# Altium schematic sheet Motor1.SchDoc
size A3; DocumentNumber: 2; SheetNumber: 4; SheetTotal: 5
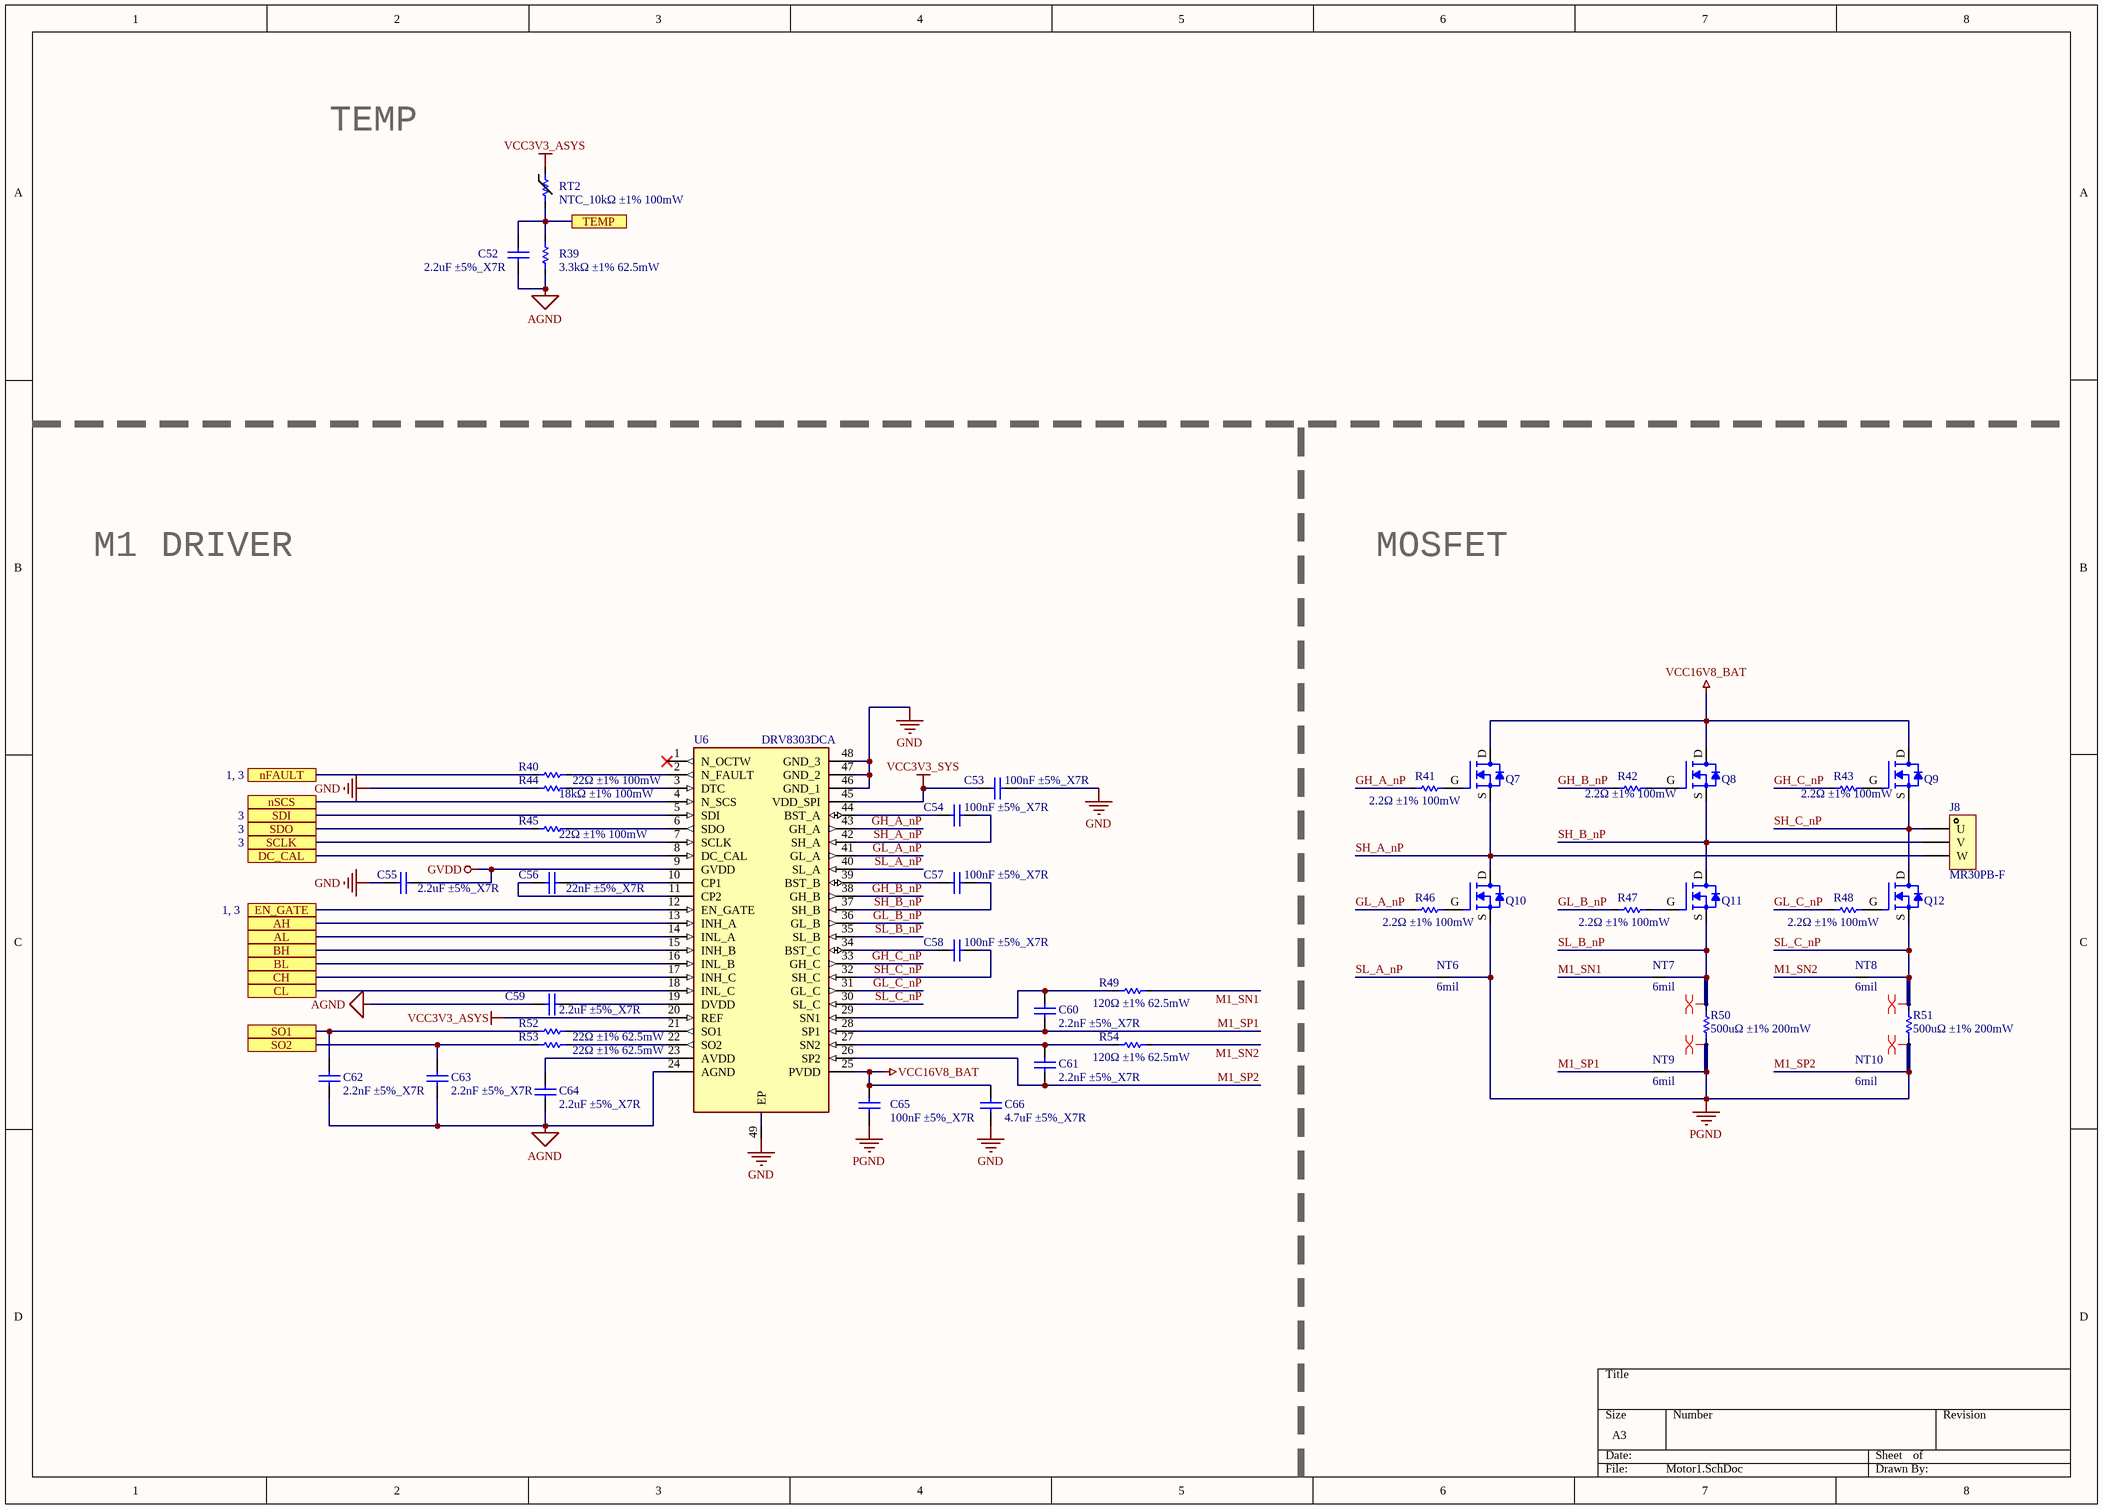
[diagram p0: Motor1.SchDoc]

## Parts
C52  2.2uF ±5%_X7R  [C0402]
C53  100nF ±5%_X7R  [C0402]
C54  100nF ±5%_X7R  [C0402]
C55  2.2uF ±5%_X7R  [C0402]
C56  22nF ±5%_X7R  [C0402]
C57  100nF ±5%_X7R  [C0402]
C58  100nF ±5%_X7R  [C0402]
C59  2.2uF ±5%_X7R  [C0402]
C60  2.2nF ±5%_X7R  [C0402]
C61  2.2nF ±5%_X7R  [C0402]
C62  2.2nF ±5%_X7R  [C0402]
C63  2.2nF ±5%_X7R  [C0402]
C64  2.2uF ±5%_X7R  [C0402]
C65  100nF ±5%_X7R  [C0402]
C66  4.7uF ±5%_X7R  [C0603]
J8  MR30PB-F  [MR30PB-F [Straight] [SMT]]
NT6  6mil  [NETTIE_6mil]  (net tie, no BOM)
NT7  6mil  [NETTIE_6mil]  (net tie, no BOM)
NT8  6mil  [NETTIE_6mil]  (net tie, no BOM)
NT9  6mil  [NETTIE_6mil]  (net tie, no BOM)
NT10  6mil  [NETTIE_6mil]  (net tie, no BOM)
Q7  BSC027N04LSG  [NRVTS10100EMFST1G]  (value not drawn)
Q8  BSC027N04LSG  [NRVTS10100EMFST1G]  (value not drawn)
Q9  BSC027N04LSG  [NRVTS10100EMFST1G]  (value not drawn)
Q10  BSC027N04LSG  [NRVTS10100EMFST1G]  (value not drawn)
Q11  BSC027N04LSG  [NRVTS10100EMFST1G]  (value not drawn)
Q12  BSC027N04LSG  [NRVTS10100EMFST1G]  (value not drawn)
R39  3.3kΩ ±1% 62.5mW  [R0402]
R40  22Ω ±1% 100mW  [R0402]
R41  2.2Ω ±1% 100mW  [R0402]
R42  2.2Ω ±1% 100mW  [R0402]
R43  2.2Ω ±1% 100mW  [R0402]
R44  18kΩ ±1% 100mW  [R0402]
R45  22Ω ±1% 100mW  [R0402]
R46  2.2Ω ±1% 100mW  [R0402]
R47  2.2Ω ±1% 100mW  [R0402]
R48  2.2Ω ±1% 100mW  [R0402]
R49  120Ω ±1% 62.5mW  [R0402]
R50  500uΩ ±1% 200mW  [R2512]
R51  500uΩ ±1% 200mW  [R2512]
R52  22Ω ±1% 62.5mW  [R0402]
R53  22Ω ±1% 62.5mW  [R0402]
R54  120Ω ±1% 62.5mW  [R0402]
RT2  NTC_10kΩ ±1% 100mW  [R0402]
U6  DRV8303DCA  [SOP50P810X120-49N]

## Ports
AH, AL, BH, BL, CH, CL, DC_CAL, EN_GATE (see 1, 3), nFAULT (see 1, 3), nSCS, SCLK (see 3), SDI (see 3), SDO (see 3), SO1, SO2, TEMP

## Nets
AGND: C52.1 C59.2 C62.1 C63.1 C64.1 R39.1 U6.24(AGND)
GND: C53.1 C55.1 C66.1 R44.2 U6.46(GND_1) U6.47(GND_2) U6.48(GND_3) U6.49(EP)
GVDD: C55.2 U6.9(GVDD)
PGND: C65.1 NT6.1 NT9.2 NT10.2 Q10.S R50.1 R51.1
VCC3V3_ASYS: RT2.1 U6.20(REF)
VCC3V3_SYS: C53.2 U6.45(VDD_SPI)
VCC16V8_BAT: C65.2 C66.2 Q7.D Q8.D Q9.D U6.25(PVDD)
AH: U6.13(INH_A) ; port AH
AL: U6.14(INL_A) ; port AL
BH: U6.15(INH_B) ; port BH
BL: U6.16(INL_B) ; port BL
CH: U6.17(INH_C) ; port CH
CL: U6.18(INL_C) ; port CL
DC_CAL: U6.8(DC_CAL) ; port DC_CAL
EN_GATE: U6.12(EN_GATE) ; port EN_GATE
GH_A_nP: R41.2 U6.43(GH_A)
GH_B_nP: R42.2 U6.38(GH_B)
GH_C_nP: R43.2 U6.33(GH_C)
GL_A_nP: R46.2 U6.41(GL_A)
GL_B_nP: R47.2 U6.36(GL_B)
GL_C_nP: R48.2 U6.31(GL_C)
M1_SN1: NT7.1 R49.1
M1_SN2: NT8.1 R54.1
M1_SP1: C60.1 NT9.1 U6.28(SP1)
M1_SP2: C61.1 NT10.1 U6.26(SP2)
nFAULT: R40.1 ; port nFAULT
nSCS: U6.4(N_SCS) ; port nSCS
SCLK: U6.7(SCLK) ; port SCLK
SDI: U6.5(SDI) ; port SDI
SDO: R45.1 ; port SDO
SH_A_nP: C54.1 J8.3(W) Q7.S Q10.D U6.42(SH_A)
SH_B_nP: C57.1 J8.2(V) Q8.S Q11.D U6.37(SH_B)
SH_C_nP: C58.1 J8.1(U) Q9.S Q12.D U6.32(SH_C)
SL_A_nP: NT6.2 U6.40(SL_A)
SL_B_nP: NT7.2 Q11.S R50.2 U6.35(SL_B)
SL_C_nP: NT8.2 Q12.S R51.2 U6.30(SL_C)
SO1: C62.2 R52.2 ; port SO1
SO2: C63.2 R53.2 ; port SO2
TEMP: C52.2 R39.2 RT2.2 ; port TEMP
NetC54_2: C54.2 U6.44(BST_A)
NetC56_1: C56.1 U6.10(CP1)
NetC56_2: C56.2 U6.11(CP2)
NetC57_2: C57.2 U6.39(BST_B)
NetC58_2: C58.2 U6.34(BST_C)
NetC59_1: C59.1 U6.19(DVDD)
NetC60_2: C60.2 R49.2 U6.29(SN1)
NetC61_2: C61.2 R54.2 U6.27(SN2)
NetC64_2: C64.2 U6.23(AVDD)
NetQ7_G: Q7.G R41.1
NetQ8_G: Q8.G R42.1
NetQ9_G: Q9.G R43.1
NetQ10_G: Q10.G R46.1
NetQ11_G: Q11.G R47.1
NetQ12_G: Q12.G R48.1
NetR40_2: R40.2 U6.2(N_FAULT)
NetR44_1: R44.1 U6.3(DTC)
NetR45_2: R45.2 U6.6(SDO)
NetR52_1: R52.1 U6.21(SO1)
NetR53_1: R53.1 U6.22(SO2)

Not connected (* = marked no-connect by the designer): U6 1(N_OCTW)*

## Notes on the sheet
- TEMP
- M1
- DRIVER
- MOSFET

## Library data of the parts
C52-C54 C56-C58 C60-C63 C65 C66 = Cap: Capacitor; Published: 8-Jun-2000; LatestRevisionDate: 17-Jul-2002; LatestRevisionNote: Re-released for DXP Platform.; PackageReference: RAD-0.3; Publisher: Altium Limited; PackageDescription: Radial Cap, Thru-Hole; 2 Leads; 0.3 in Pin Spacing
C55 C59 C64 = Cap: CL05A225KO5NQNC; Published: 8-Jun-2000; LatestRevisionDate: 17-Jul-2002; LatestRevisionNote: Re-released for DXP Platform.; PackageReference: RAD-0.3; Publisher: Altium Limited; PackageDescription: Radial Cap, Thru-Hole; 2 Leads; 0.3 in Pin Spacing
J8 = MR30PB-F [Straight] [SMT]: 驱动器端
NT6-NT10 = NETTIE
Q7-Q12 = MOSFET-N: MOSFET – Power, Single, / N-Channel, PG-TDSON-8 / SuperSO8 5x6 / 40 V, 139 A; Manufacturer: ON Semiconductor; Manufacturer Part Number: NTMFS4935NT1G; Drain to Source Voltage (Vdss): 30V; Current - Continuous Drain (Id) @ 25°C: 13A (Ta), 93A (Tc); Drive Voltage (Max Rds On,  Min Rds On): 4.5V, 10V; Vgs(th) (Max) @ Id: 2.2V @ 250µA; Gate Charge (Qg) (Max) @ Vgs: 49.4nC @ 10V; Input Capacitance (Ciss) (Max) @ Vds: 4850pF @ 15V; Vgs (Max): ±20V; Power Dissipation (Max): 930mW (Ta), 48W (Tc); Rds On (Max) @ Id, Vgs: 3.2 mOhm @ 30A, 10V; Supplier 1: Digi-Key; Supplier Part Number 1: NTMFS4935NT1GOSCT-ND; RoHS: RoHS Compliant; Category: Discrete Semiconductor Products; Stock 1: 932; Pricing 1: 1=0.61, 10=0.541, 100=0.4145, 500=0.3277 (USD); Packaging: Cut Tape (CT); Part Status: Active; FET Type: N-Channel; Technology: MOSFET (Metal Oxide); FET Feature: -; Operating Temperature: -55°C ~ 150°C (TJ); Mounting Type: Surface Mount; Supplier Device Package: 5-DFN (5x6) (8-SOFL); Package / Case: 8-PowerTDFN, 5 Leads; ComponentLink1URL: http://www.onsemi.com/pub_link/Collateral/NTMFS4935N-D.PDF; ComponentLink1Description: http://www.onsemi.com/pub_link/Collateral/NTMFS4935N-D.PDF
R39-R54 = Res: Resistor; Published: 8-Jun-2000; LatestRevisionDate: 17-Jul-2002; LatestRevisionNote: Re-released for DXP Platform.; PackageReference: AXIAL-0.3; Publisher: Altium Limited; PackageDescription: Axial Device, Thru-Hole; 2 Leads; 0.3 in Pin Spacing
RT2 = TEMP RES: THERMISTOR 10K OHM NTC 0402 SMD
U6 = DRV8303DCA: Integrated Circuit; Manufacturer_Name: Texas Instruments; Datasheet Link: https://componentsearchengine.com/Datasheets/2/DRV8303DCA.pdf; Height: 1.2mm; Manufacturer_Part_Number: DRV8303DCA; Mouser Part Number: 595-DRV8303DCA; Mouser Price/Stock: https://www.mouser.co.uk/ProductDetail/Texas-Instruments/DRV8303DCA?qs=igp4D3uu33KLowzNFy6WPA%3D%3D; Arrow Part Number: DRV8303DCA; Arrow Price/Stock: https://www.arrow.com/en/products/drv8303dca/texas-instruments